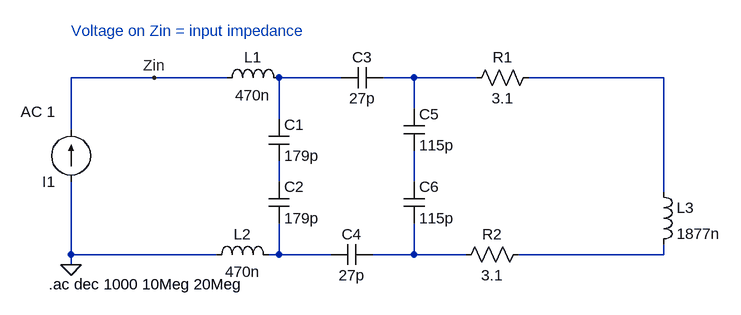
[diagram p0: schematic NFC-simulation.asc]
NFC-simulation.asc, the LTspice schematic file:
Version 4
SHEET 1 1008 680
WIRE 128 32 0 32
WIRE 240 32 128 32
WIRE 416 32 320 32
WIRE 528 32 480 32
WIRE 624 32 528 32
WIRE 912 32 704 32
WIRE 528 80 528 32
WIRE 320 96 320 32
WIRE 0 112 0 32
WIRE 320 192 320 160
WIRE 528 192 528 144
WIRE 912 208 912 32
WIRE 0 304 0 192
WIRE 224 304 0 304
WIRE 320 304 320 256
WIRE 320 304 304 304
WIRE 400 304 320 304
WIRE 528 304 528 256
WIRE 528 304 464 304
WIRE 608 304 528 304
WIRE 912 304 912 288
WIRE 912 304 688 304
WIRE 0 320 0 304
FLAG 0 320 0
FLAG 128 32 Zin
SYMBOL ind 224 48 R270
WINDOW 0 32 56 VTop 2
WINDOW 3 5 56 VBottom 2
SYMATTR InstName L1
SYMATTR Value 470n
SYMBOL cap 304 96 R0
SYMATTR InstName C1
SYMATTR Value 179p
SYMBOL ind 208 320 R270
WINDOW 0 32 56 VTop 2
WINDOW 3 5 56 VBottom 2
SYMATTR InstName L2
SYMATTR Value 470n
SYMBOL cap 304 192 R0
SYMATTR InstName C2
SYMATTR Value 179p
SYMBOL current 0 192 R180
WINDOW 123 24 108 Left 2
WINDOW 39 0 0 Left 0
SYMATTR InstName I1
SYMATTR Value ""
SYMATTR Value2 AC 1
SYMBOL cap 480 16 R90
WINDOW 0 0 32 VBottom 2
WINDOW 3 32 32 VTop 2
SYMATTR InstName C3
SYMATTR Value 27p
SYMBOL cap 464 288 R90
WINDOW 0 0 32 VBottom 2
WINDOW 3 32 32 VTop 2
SYMATTR InstName C4
SYMATTR Value 27p
SYMBOL cap 512 80 R0
SYMATTR InstName C5
SYMATTR Value 115p
SYMBOL cap 512 192 R0
SYMATTR InstName C6
SYMATTR Value 115p
SYMBOL res 720 16 R90
WINDOW 0 0 56 VBottom 2
WINDOW 3 32 56 VTop 2
SYMATTR InstName R1
SYMATTR Value 3.1
SYMBOL res 704 288 R90
WINDOW 0 0 56 VBottom 2
WINDOW 3 32 56 VTop 2
SYMATTR InstName R2
SYMATTR Value 3.1
SYMBOL ind 896 192 R0
SYMATTR InstName L3
SYMATTR Value 1877n
TEXT -34 350 Left 2 !.ac dec 1000 10Meg 20Meg
TEXT 0 -40 Left 2 ;Voltage on Zin = input impedance

The netlist it stands for:
* NFC-simulation.asc
L1 Zin N001 470n
C1 N001 N004 179p
L2 0 N006 470n
C2 N004 N006 179p
I1 0 Zin AC 1
C3 N002 N001 27p
C4 N007 N006 27p
C5 N002 N005 115p
C6 N005 N007 115p
R1 N003 N002 3.1
R2 N008 N007 3.1
L3 N003 N008 1877n
.ac dec 1000 10Meg 20Meg
* Voltage on Zin = input impedance
.backanno
.end